# Altium project DSO.PrjPCB
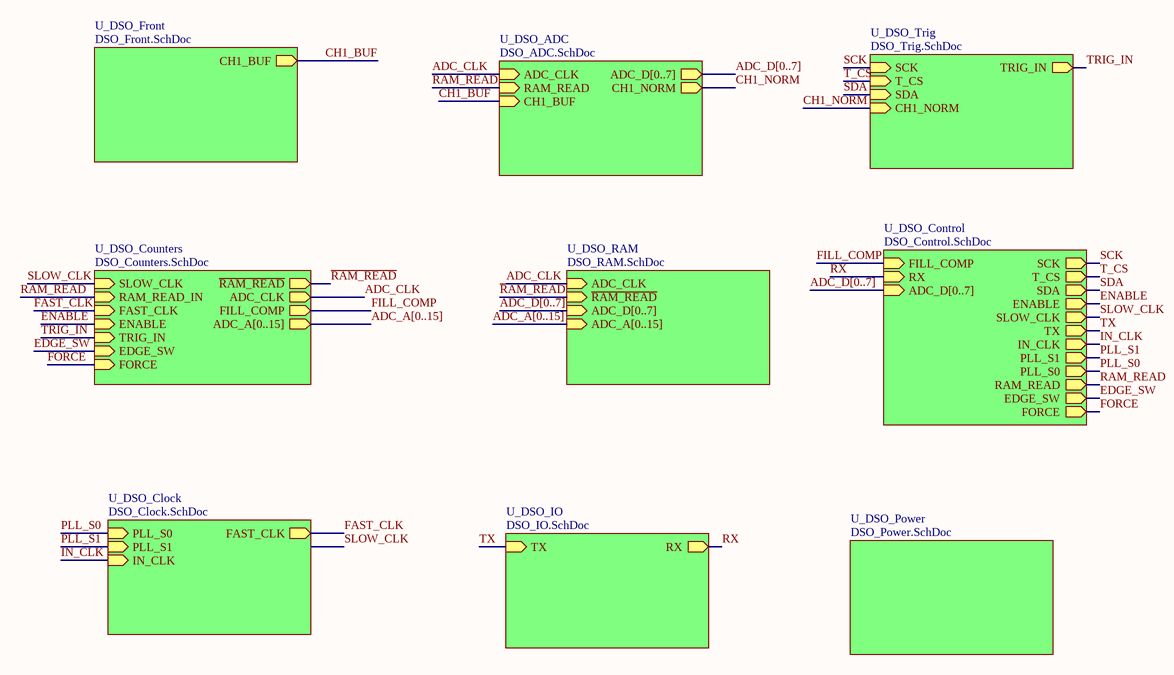
[diagram p0: DSO_Top.SchDoc]
7 sheets, 96 parts. Net scope: hierarchical (ports join the sheet entries above them; power ports are global).
Board file: DSO.PcbDoc
Sheets:
  DSO_Top.SchDoc
    U_DSO_ADC = DSO_ADC.SchDoc
    U_DSO_Clock = DSO_Clock.SchDoc
    U_DSO_Front = DSO_Front.SchDoc
    U_DSO_IO = DSO_IO.SchDoc
    U_DSO_Power = DSO_Power.SchDoc
    U_DSO_Trig = DSO_Trig.SchDoc

## Sheet DSO_Top.SchDoc: Schematic_Name
size A4; CompanyName: University of Melbourne; Engineer: Your Name Here; DocumentNumber: 1; Revision: 0.1; SheetNumber: 1; SheetTotal: 1; Title_Project: Project_Title; StudentNo: Student No.

### Sub-sheets
U_DSO_ADC = DSO_ADC.SchDoc: ADC_CLK (in), ADC_D[0..7] (out), RAM_READ (in), CH1_BUF (in), CH1_NORM (out)
U_DSO_Clock = DSO_Clock.SchDoc: FAST_CLK (out), PLL_S0 (in), PLL_S1 (in), IN_CLK (in)
U_DSO_Control = DSO_Control.SchDoc (file not in this document): SCK (out), T_CS (out), SDA (out), ENABLE (out), FILL_COMP (in), SLOW_CLK (out), TX (out), RX (in), IN_CLK (out), PLL_S1 (out), PLL_S0 (out), RAM_READ (out), ADC_D[0..7] (in), EDGE_SW (out), FORCE (out)
U_DSO_Counters = DSO_Counters.SchDoc (file not in this document): SLOW_CLK (in), ~{RAM_READ} (out), ADC_CLK (out), RAM_READ_IN (in), FAST_CLK (in), FILL_COMP (out), ENABLE (in), TRIG_IN (in), EDGE_SW (in), FORCE (in), ADC_A[0..15] (out)
U_DSO_Front = DSO_Front.SchDoc: CH1_BUF (out)
U_DSO_IO = DSO_IO.SchDoc: TX (in), RX (out)
U_DSO_Power = DSO_Power.SchDoc: no entries
U_DSO_RAM = DSO_RAM.SchDoc (file not in this document): ADC_CLK (in), ~{RAM_READ} (in), ADC_D[0..7] (in), ADC_A[0..15] (in)
U_DSO_Trig = DSO_Trig.SchDoc: SCK (in), T_CS (in), SDA (in), CH1_NORM (in), TRIG_IN (out)

### Nets
ADC_CLK: sheet U_DSO_ADC/ADC_CLK, sheet U_DSO_Counters/ADC_CLK, sheet U_DSO_RAM/ADC_CLK
CH1_BUF: sheet U_DSO_ADC/CH1_BUF, sheet U_DSO_Front/CH1_BUF
CH1_NORM: sheet U_DSO_ADC/CH1_NORM, sheet U_DSO_Trig/CH1_NORM
EDGE_SW: sheet U_DSO_Control/EDGE_SW, sheet U_DSO_Counters/EDGE_SW
ENABLE: sheet U_DSO_Control/ENABLE, sheet U_DSO_Counters/ENABLE
FAST_CLK: sheet U_DSO_Clock/FAST_CLK, sheet U_DSO_Counters/FAST_CLK
FILL_COMP: sheet U_DSO_Control/FILL_COMP, sheet U_DSO_Counters/FILL_COMP
FORCE: sheet U_DSO_Control/FORCE, sheet U_DSO_Counters/FORCE
IN_CLK: sheet U_DSO_Clock/IN_CLK, sheet U_DSO_Control/IN_CLK
PLL_S0: sheet U_DSO_Clock/PLL_S0, sheet U_DSO_Control/PLL_S0  [project net Clk_S0]
PLL_S1: sheet U_DSO_Clock/PLL_S1, sheet U_DSO_Control/PLL_S1  [project net Clk_S1]
~{RAM_READ}: sheet U_DSO_Counters/~{RAM_READ}, sheet U_DSO_RAM/~{RAM_READ}
RAM_READ: sheet U_DSO_ADC/RAM_READ, sheet U_DSO_Control/RAM_READ, sheet U_DSO_Counters/RAM_READ_IN
RX: sheet U_DSO_Control/RX, sheet U_DSO_IO/RX  [project net MCU_RX]
SCK: sheet U_DSO_Control/SCK, sheet U_DSO_Trig/SCK
SDA: sheet U_DSO_Control/SDA, sheet U_DSO_Trig/SDA
SLOW_CLK: sheet U_DSO_Control/SLOW_CLK, sheet U_DSO_Counters/SLOW_CLK
T_CS: sheet U_DSO_Control/T_CS, sheet U_DSO_Trig/T_CS
TRIG_IN: sheet U_DSO_Counters/TRIG_IN, sheet U_DSO_Trig/TRIG_IN
TX: sheet U_DSO_Control/TX, sheet U_DSO_IO/TX  [project net MCU_TX]

### Buses and harness runs
bus ADC_A[0..15] = sheet U_DSO_Counters/ADC_A[0..15]
bus ADC_A[0..15] = sheet U_DSO_RAM/ADC_A[0..15]
bus ADC_D[0..7] = sheet U_DSO_ADC/ADC_D[0..7]
bus ADC_D[0..7] = sheet U_DSO_Control/ADC_D[0..7]
bus ADC_D[0..7] = sheet U_DSO_RAM/ADC_D[0..7]

## Sheet DSO_ADC.SchDoc: Schematic_Name
size A4; CompanyName: University of Melbourne; Engineer: Your Name Here; DocumentNumber: 1; Revision: 0.1; SheetNumber: 1; SheetTotal: 1; Title_Project: Project_Title; StudentNo: Student No.
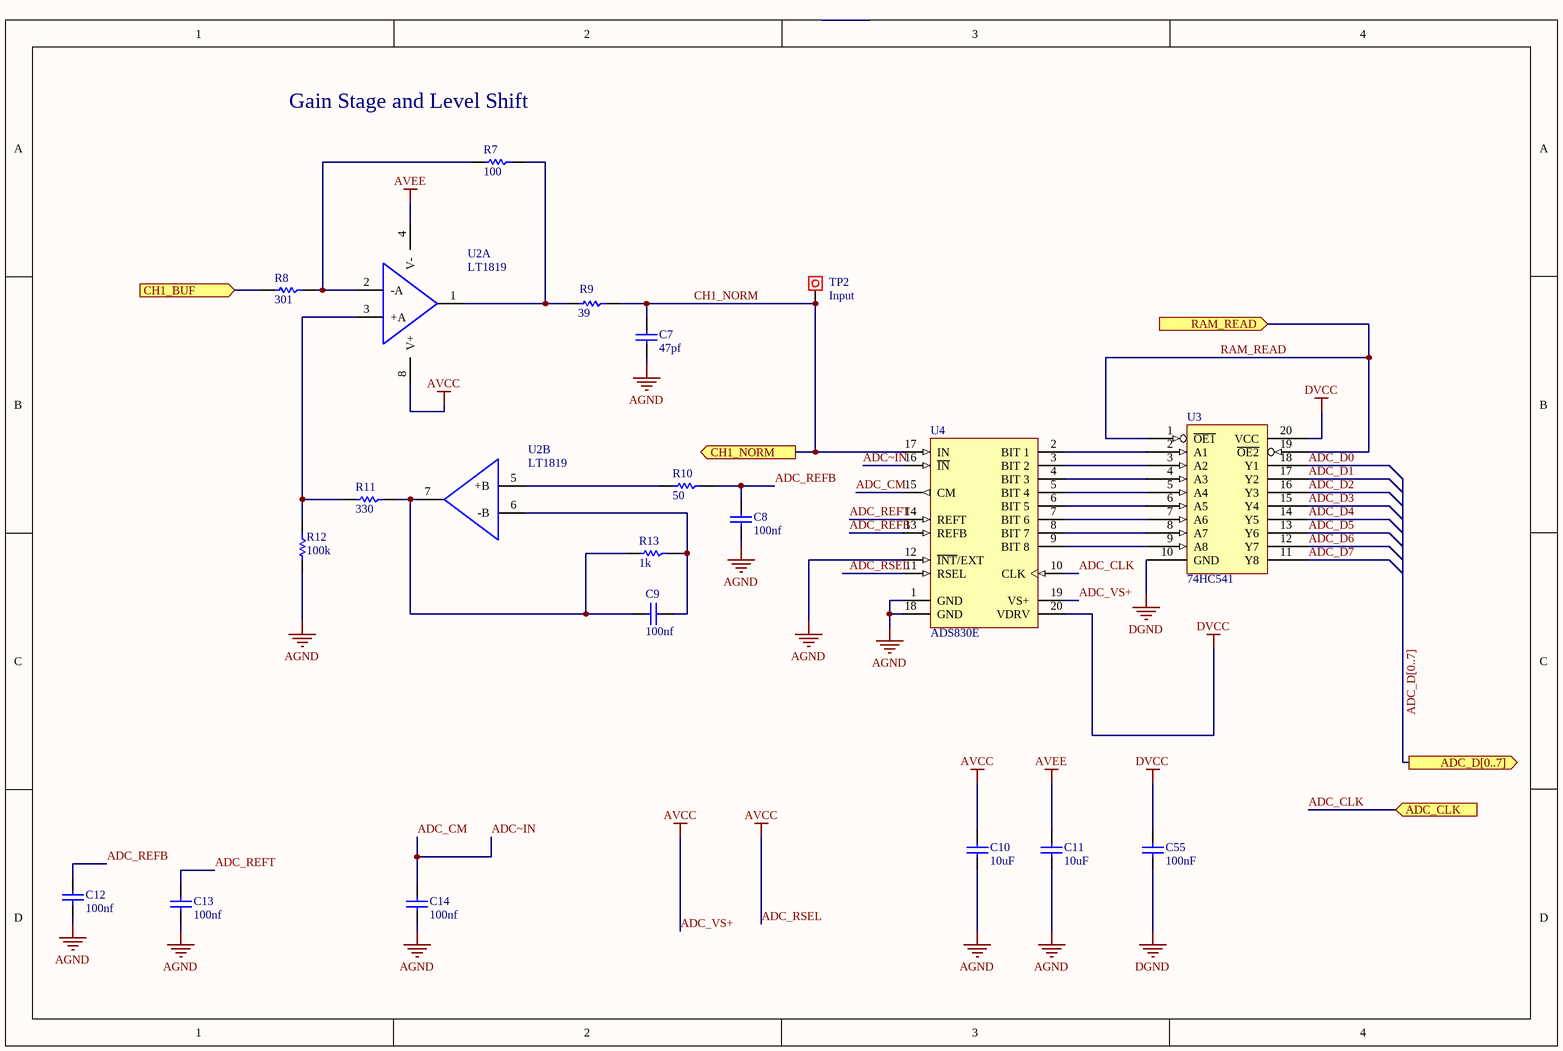
[diagram p1: DSO_ADC.SchDoc]

### Parts
C7  47pf  [0805C]
C8  100nf  [0805C]
C9  100nf  [0805C]
C10  10uF  [0805C]
C11  10uF  [0805C]
C12  100nf  [0805C]
C13  100nf  [0805C]
C14  100nf  [0805C]
C55  100nF  [0805C]
R7  100  [0805]
R8  301  [0805]
R9  39  [0805]
R10  50  [0805]
R11  330  [0805]
R12  100k  [0805]
R13  1k  [0805]
TP2  INPUT  [Testpoin]
U2  LT1819  [MSOP-8]  (parts A,B of 2)
U3  74HC541  [SOT163-1_N]
U4  ADS830E  [TI-DBQ20_L]

### Ports
ADC_CLK (in), ADC_D[0..7] (out), CH1_BUF (in), CH1_NORM (out), RAM_READ (in)

### Nets
ADC_RSEL: C10.1 U2.8(V+) U4.11(RSEL) U4.19(VS+)  [also labelled ADC_VS+, AVCC]
AGND: C7.2 C8.1 C10.2 C11.2 C12.1 C13.1 C14.1 R12.2 U4.1(GND) U4.12(~{INT}/EXT) U4.18(GND)
AVEE: C11.1 U2.4(V-)
DGND: C55.2 U3.10(GND)
DVCC: C55.1 U3.20(VCC) U4.20(VDRV)
ADC_CLK: U4.10(CLK) ; port ADC_CLK
ADC_CM: C14.2 U4.15(CM) U4.16(~{IN})  [also labelled ADC~IN]
ADC_D0: U3.18(Y1)
ADC_D1: U3.17(Y2)
ADC_D2: U3.16(Y3)
ADC_D3: U3.15(Y4)
ADC_D4: U3.14(Y5)
ADC_D5: U3.13(Y6)
ADC_D6: U3.12(Y7)
ADC_D7: U3.11(Y8)
ADC_REFB: C8.2 C12.2 R10.1 U4.13(REFB)
ADC_REFT: C13.2 U4.14(REFT)
CH1_BUF: R8.2 ; port CH1_BUF
CH1_NORM: C7.1 R9.1 TP2.1 U4.17(IN) ; port CH1_NORM
RAM_READ: U3.1(~{OE1}) U3.19(~{OE2}) ; port RAM_READ
NetC9_1: C9.1 R11.1 R13.2 U2.7(OUTB)
NetC9_2: C9.2 R13.1 U2.6(-B)
NetR7_1: R7.1 R9.2 U2.1(OUTA)
NetR7_2: R7.2 R8.1 U2.2(-A)
NetR10_2: R10.2 U2.5(+B)
NetR11_2: R11.2 R12.1 U2.3(+A)
NetU3_2: U3.2(A1) U4.2(BIT_1)
NetU3_3: U3.3(A2) U4.3(BIT_2)
NetU3_4: U3.4(A3) U4.4(BIT_3)
NetU3_5: U3.5(A4) U4.5(BIT_4)
NetU3_6: U3.6(A5) U4.6(BIT_5)
NetU3_7: U3.7(A6) U4.7(BIT_6)
NetU3_8: U3.8(A7) U4.8(BIT_7)
NetU3_9: U3.9(A8) U4.9(BIT_8)

### Buses and harness runs
bus ADC_D[0..7] = port ADC_D[0..7]

### Notes on the sheet
- (near R7) Gain Stage and Level Shift

### Library data of the parts
C7-C14 C55 = C: Capacitor; Reviewed by: RM - 2018/08/05; Revision: July-2002: Re-released for DXP Platform.; Supplier 1: *; Supplier Part Number 1: *
  C7: Value: 47pf
  C8 C9 C12-C14: Value: 100nf
  C10 C11: Value: 10uF
  C55: Value: 100nF
R7-R13 = R: Resistor; Reviewed by: RM - 2018/08/05; Supplier 1: *; Suppler Part Number 1: *
  R7: Value: 100
  R8: Value: 301
  R9: Value: 39
  R10: Value: 50
  R11: Value: 330
  R12: Value: 100k
  R13: Value: 1k
TP2 = Test Point: Pad; Value: Input
U2 = LT1819: OpAmp High Frequency Dual; Reviewed by: RM - 2018/08/05; Supplier 1: Digi-Key; Supplier Part Number 1: LT1819CMS8#PBF-ND
U3 = 74HC541: (ADV) Octal Buffer, Line Driver; Reviewed by: RM - 2018/08/05; Supplier 1: Digi-Key; Supplier Part Number 1: 296-1202-1-ND
U4 = ADS830E: 8-Bit, 60 MSPS ADC Single-Ended / Differential Input, Internal / External Reference and Programmble Input Range, -40 to 85 degC, 20-pin SOP (DBQ20), Green (RoHS & no Sb/Br); Reviewed by: RM - 2018/08/05; ComponentLink2URL: http://www.ti.com/general/docs/lit/getliterature.tsp?genericPartNumber=ADS830&fileType=pdf; ComponentLink2Description: Datasheet; ComponentLink1URL: http://www.ti.com/; ComponentLink3URL: http://www.ti.com/litv/pdf/mpds210a; ComponentLink3Description: Package Specification; ComponentLink1Description: Manufacturer URL; Supplier 1: Digi-Key; Supplier Part Number 1: ADS830E-ND

## Sheet DSO_Clock.SchDoc: Schematic_Name
size A4; CompanyName: University of Melbourne; Engineer: Your Name Here; DocumentNumber: 1; Revision: 0.1; SheetNumber: 1; SheetTotal: 1; Title_Project: Project_Title; StudentNo: Student No.
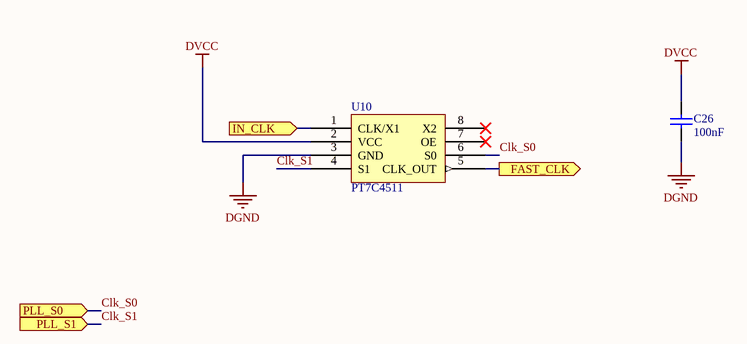
[diagram p2: DSO_Clock.SchDoc]

### Parts
C26  100nF  [0805C]
U10  PT7C4511  [SOIC-8]

### Ports
FAST_CLK (out), IN_CLK (in), PLL_S0 (in), PLL_S1 (in)

### Nets
DGND: C26.2 U10.3(GND)
DVCC: C26.1 U10.2(VCC)
Clk_S0: U10.6(S0) ; port PLL_S0
Clk_S1: U10.4(S1) ; port PLL_S1
FAST_CLK: U10.5(CLK_OUT) ; port FAST_CLK
IN_CLK: U10.1(CLK/X1) ; port IN_CLK

Not connected (* = marked no-connect by the designer): U10 7(OE)* 8(X2)*

### Library data of the parts
C26 = C: Capacitor; Reviewed by: RM - 2018/08/05; Revision: July-2002: Re-released for DXP Platform.; Supplier 1: *; Supplier Part Number 1: *; Value: 100nF
U10 = PT7C4511: PLL Clock Multiplier; Reviewed by: RM - 2018/08/05; Supplier 1: Digi-Key; Supplier Part Number 1: PT7C4511WEXDICT-ND

## Sheet DSO_Front.SchDoc: Schematic_Name
size A4; CompanyName: University of Melbourne; Engineer: Your Name Here; DocumentNumber: 1; Revision: 0.1; SheetNumber: 1; SheetTotal: 1; Title_Project: Project_Title; StudentNo: Student No.
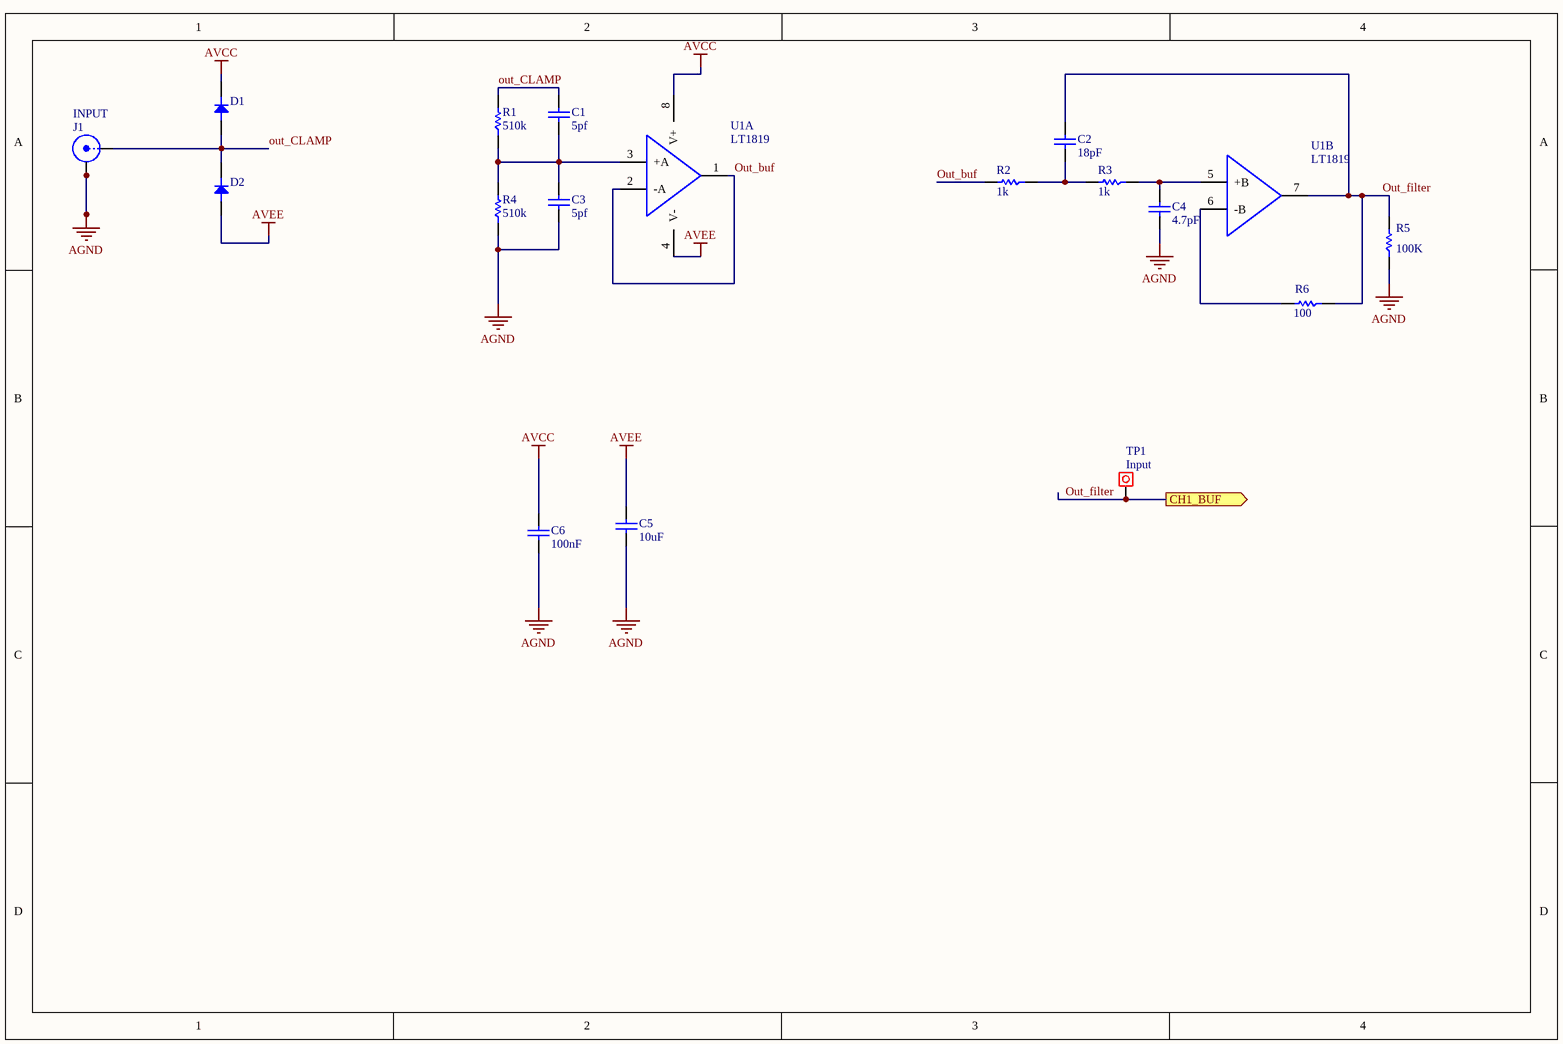
[diagram p3: DSO_Front.SchDoc]

### Parts
C1  5pf  [0805C]
C2  18pF  [0805C]
C3  5pf  [0805C]
C4  4.7pF  [0805C]
C5  10uF  [0805C]
C6  100nF  [0805C]
D1  Diode  [SOD-123]  (value not drawn)
D2  Diode  [SOD-123]  (value not drawn)
J1  INPUT  [BNC_VERT]
R1  510k  [0805]
R2  1k  [0805]
R3  1k  [0805]
R4  510k  [0805]
R5  100K  [0805]
R6  100  [0805]
TP1  INPUT  [Testpoin]
U1  LT1819  [MSOP-8]  (parts A,B of 2)

### Ports
CH1_BUF (out)

### Nets
AGND: C3.2 C4.2 C5.2 C6.2 J1.2(Y) J1.3(Y) J1.4(Y) J1.5(Y) R4.1 R5.1
AVCC: C6.1 D1.K U1.8(V+)  [project net ADC_RSEL]
AVEE: C5.1 D2.A U1.4(V-)
Out_buf: R2.2 U1.1(OUTA) U1.2(-A)
out_CLAMP: C1.1 D1.A D2.K J1.1(X) R1.2
Out_filter: C2.1 R5.2 R6.1 TP1.1 U1.7(OUTB) ; port CH1_BUF  [project net CH1_BUF]
NetC1_2: C1.2 C3.1 R1.1 R4.2 U1.3(+A)
NetC2_2: C2.2 R2.1 R3.2
NetC4_1: C4.1 R3.1 U1.5(+B)
NetR6_2: R6.2 U1.6(-B)

### Library data of the parts
C1-C6 = C: Capacitor; Reviewed by: RM - 2018/08/05; Revision: July-2002: Re-released for DXP Platform.; Supplier 1: *; Supplier Part Number 1: *
  C1 C3: Value: 5pf
  C2: Value: 18pF
  C4: Value: 4.7pF
  C5: Value: 10uF
  C6: Value: 100nF
D1 D2 = D: Reviewed by: RM - 2018/08/05; Revision: July-2002: Re-released for DXP Platform.; Supplier 1: *; Supplier Part Number 1: *
J1 = BNC: BNC Straight; Reviewed by: RM - 2018/08/05; Supplier Part Number 1: A97581-ND; Supplier 1: Digi-Key
R1-R6 = R: Resistor; Reviewed by: RM - 2018/08/05; Supplier 1: *; Suppler Part Number 1: *
  R1 R4: Value: 510k
  R2 R3: Value: 1k
  R5: Value: 100K
  R6: Value: 100
TP1 = Test Point: Pad; Value: Input
U1 = LT1819: as U2 on sheet DSO_ADC; Supplier 1: Digi-Key; Supplier Part Number 1: LT1819CMS8#PBF-ND

## Sheet DSO_IO.SchDoc: Schematic_Name
size A4; CompanyName: University of Melbourne; Engineer: Your Name Here; DocumentNumber: 1; Revision: 0.1; SheetNumber: 1; SheetTotal: 1; Title_Project: Project_Title; StudentNo: Student No.
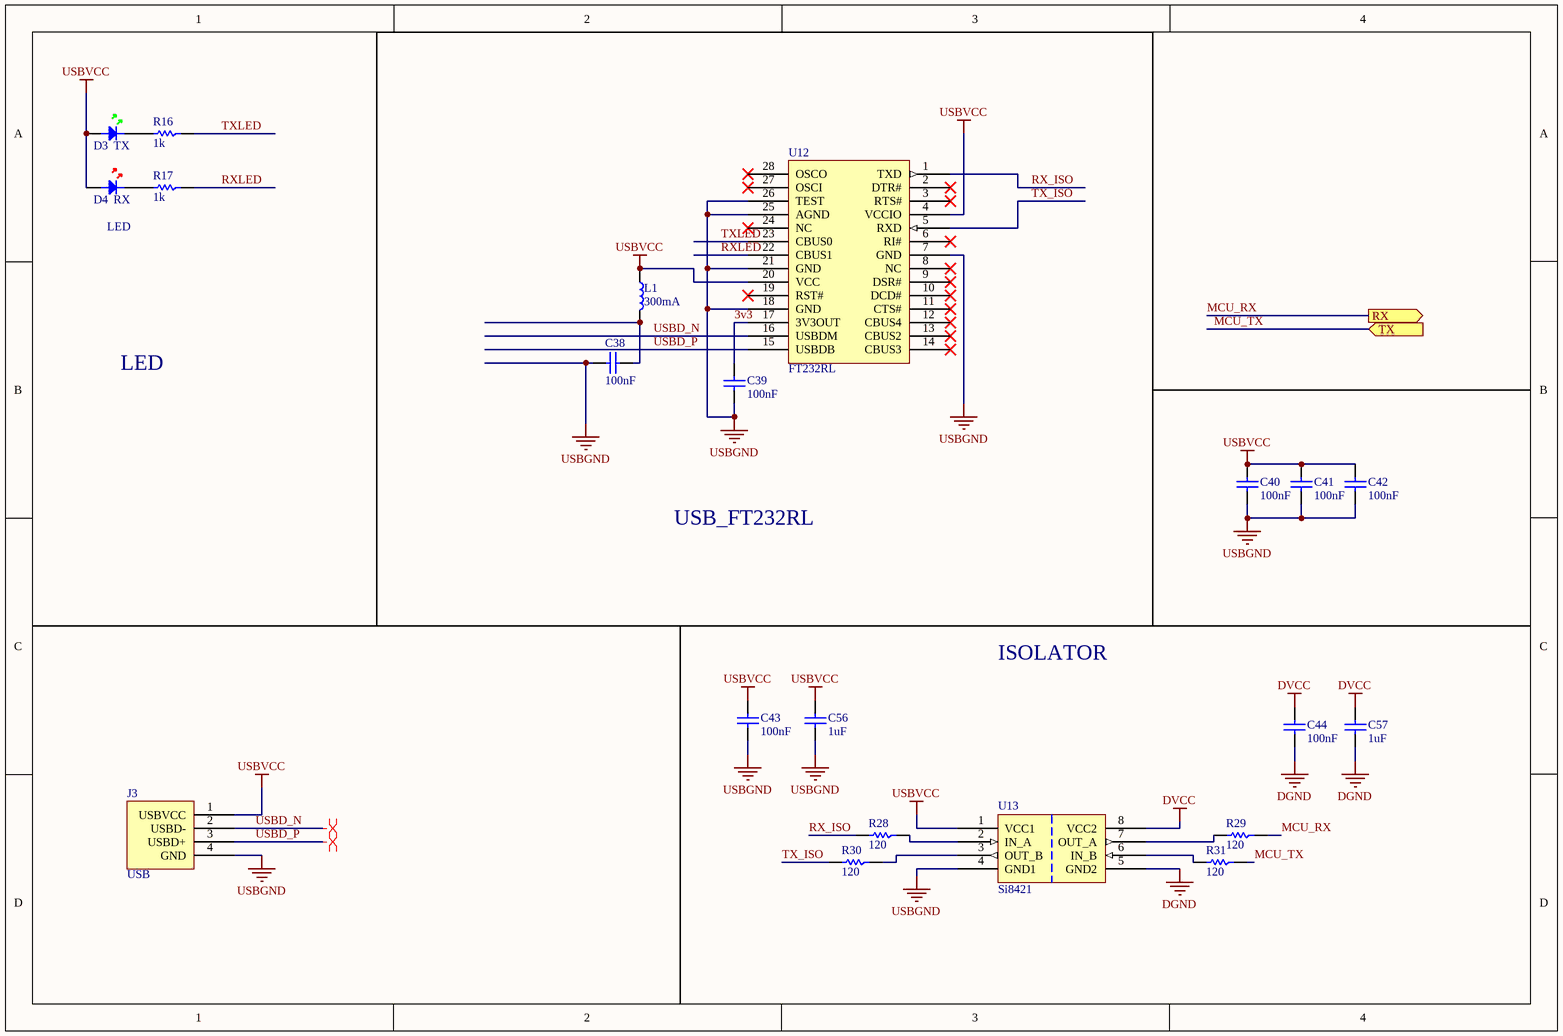
[diagram p4: DSO_IO.SchDoc]

### Parts
C38  100nF  [0805C]
C39  100nF  [0805C]
C40  100nF  [0805C]
C41  100nF  [0805C]
C42  100nF  [0805C]
C43  100nF  [0805C]
C44  100nF  [0805C]
C56  1uF  [0805C]
C57  1uF  [0805C]
D3  TX  [0805D-GREEN]
D4  RX  [0805D-RED]
J3  USB  [USBPLUG]
L1  300mA  [0805]
R16  1k  [0805]
R17  1k  [0805]
R28  120  [0805]
R29  120  [0805]
R30  120  [0805]
R31  120  [0805]
U12  FT232RL  [SSOP-28]
U13  Si8421  [SOIC-8]

### Ports
RX (out), TX (in)

### Nets
DGND: C44.2 C57.2 U13.5(GND2)
DVCC: C44.1 C57.1 U13.8(VCC2)
USBGND: C38.2 C39.2 C40.2 C41.2 C42.2 C43.2 C56.2 J3.4(GND) U12.7(GND) U12.18(GND) U12.21(GND) U12.25(AGND) U12.26(TEST) U13.4(GND1)
USBVCC: C40.1 C41.1 C42.1 C43.1 C56.1 D3.A D4.A J3.1(USBVCC) L1.1 U12.4(VCCIO) U12.20(VCC) U13.1(VCC1)
3v3: C39.1 U12.17(3V3OUT)
MCU_RX: R29.1 ; port RX
MCU_TX: R31.1 ; port TX
RX_ISO: R28.2 U12.1(TXD)
RXLED: R17.1 U12.22(CBUS1)
TX_ISO: R30.2 U12.5(RXD)
TXLED: R16.1 U12.23(CBUS0)
USBD_N: J3.2(USBD-) U12.16(USBDM)
USBD_P: J3.3(USBD+) U12.15(USBDB)
NetC38_1: C38.1 L1.2
NetD3_K: D3.K R16.2
NetD4_K: D4.K R17.2
NetR28_1: R28.1 U13.2(IN_A)
NetR29_2: R29.2 U13.7(OUT_A)
NetR30_1: R30.1 U13.3(OUT_B)
NetR31_2: R31.2 U13.6(IN_B)

Not connected (* = marked no-connect by the designer): U12 2(DTR#)* 3(RTS#)* 6(RI#)* 8(NC)* 9(DSR#)* 10(DCD#)* 11(CTS#)* 12(CBUS4)* 13(CBUS2)* 14(CBUS3)* 19(RST#)* 24(NC)* 27(OSCI)* 28(OSCO)*

### Layout directives
differential pair: USBD_N, USBD_P

### Notes on the sheet
- LED
- USB_FT232RL
- ISOLATOR

### Library data of the parts
C38-C44 C56 C57 = C: Capacitor; Reviewed by: RM - 2018/08/05; Revision: July-2002: Re-released for DXP Platform.; Supplier 1: *; Supplier Part Number 1: *
  C38-C44: Value: 100nF
  C56 C57: Value: 1uF
D3 = LED GREEN: Light Emitting Diode; Reviewed by: RM - 2018/08/05; Revision: July-2002: Re-released for DXP Platform.; Supplier 1: Digi-Key; Supplier Part Number 1: 160-1423-1-ND
D4 = LED RED: Light Emitting Diode; Reviewed by: RM - 2018/08/05; Revision: July-2002: Re-released for DXP Platform.; Supplier 1: Digi-Key; Supplier Part Number 1: 475-1415-1-ND
J3 = USBPLUG: USB B Type Connector; Reviewed by: RM - 2018/08/05; Supplier 1: Digi-Key; Supplier Part Number 1: 609-1039-ND
L1 = I: Inductor; Reviewed by: RM - 2018/08/05; Value: 300mA; Supplier 1: *; Supplier Part Number 1: *
R16 R17 R28-R31 = R: Resistor; Reviewed by: RM - 2018/08/05; Supplier 1: *; Suppler Part Number 1: *
  R16 R17: Value: 1k
  R28-R31: Value: 120
U12 = FT232RL: USB to Serial bridge; Reviewed by: RM - 2018/08/05; Supplier 1: Digi-Key; Supplier Part Number 1: 768-1007-1-ND
U13 = Si8421: Dual Channel Digital Isolator Both Ways; Reviewed by: RM - 2018/08/05; Supplier 1: Digi-Key; Supplier Part Number 1: 336-1755-5-ND

## Sheet DSO_Power.SchDoc: Schematic_Name
size A4; CompanyName: University of Melbourne; Engineer: Your Name Here; DocumentNumber: 1; Revision: 0.1; SheetNumber: 1; SheetTotal: 1; Title_Project: Project_Title; StudentNo: Student No.
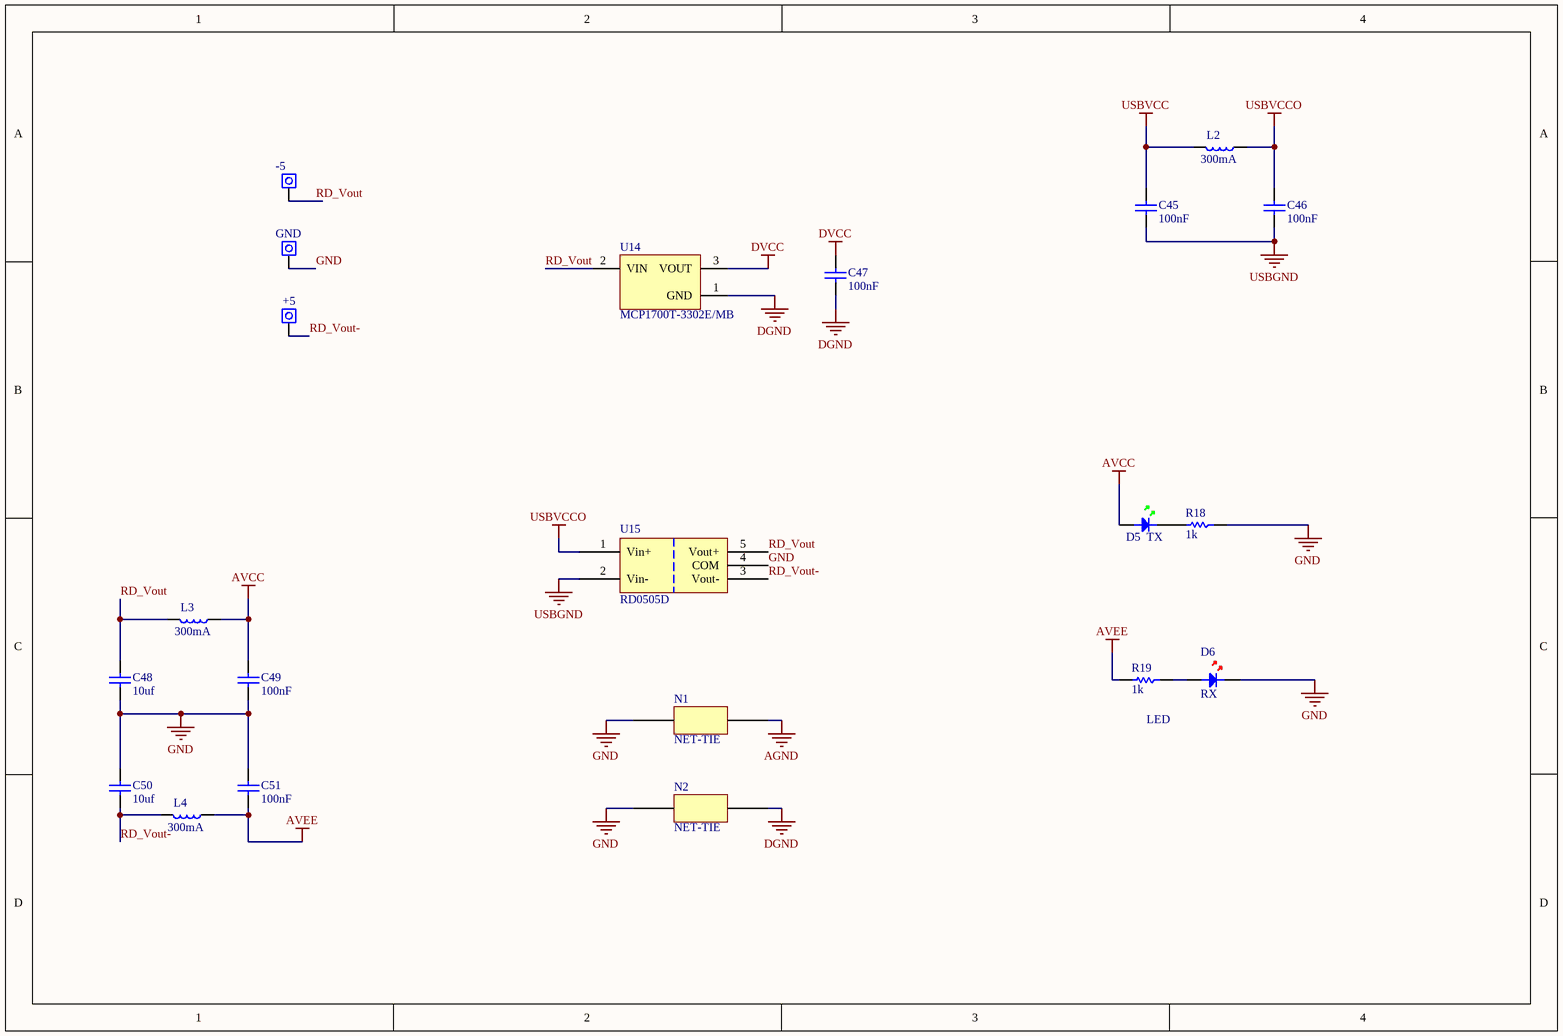
[diagram p5: DSO_Power.SchDoc]

### Parts
C45  100nF  [0805C]
C46  100nF  [0805C]
C47  100nF  [0805C]
C48  10uf  [0805C]
C49  100nF  [0805C]
C50  10uf  [0805C]
C51  100nF  [0805C]
D5  TX  [0805D-GREEN]
D6  RX  [0805D-RED]
L2  300mA  [0805]
L3  300mA  [0805]
L4  300mA  [0805]
N1  NET-TIE  [NET-TIE]  (net tie, no BOM)
N2  NET-TIE  [NET-TIE]  (net tie, no BOM)
R18  1k  [0805]
R19  1k  [0805]
TP4  -5  [PIN 1.8mm]
TP5  GND  [PIN 1.8mm]
TP6  +5  [PIN 1.8mm]
U14  MCP1700T-3302E/MB  [SOT89]
U15  RD0505D  [SIP_NMG]

### Nets
AGND: N1.1
AVCC: C49.1 D5.A L3.1  [project net ADC_RSEL]
AVEE: C51.2 L4.1 R19.2
DGND: C47.2 N2.1 U14.1(GND)
DVCC: C47.1 U14.3(VOUT)
GND: C48.2 C49.2 C50.1 C51.1 D6.A N1.0 N2.0 R18.1 TP5.1 U15.4(COM)
USBGND: C45.2 C46.2 U15.2(Vin-)
USBVCC: C45.1 L2.2
USBVCCO: C46.1 L2.1 U15.1(Vin+)
RD_Vout: C48.1 L3.2 TP4.1 U14.2(VIN) U15.5(Vout+)
RD_Vout-: C50.2 L4.2 TP6.1 U15.3(Vout-)
NetD5_K: D5.K R18.2
NetD6_K: D6.K R19.1

### Notes on the sheet
- LED

### Library data of the parts
C45-C51 = C: Capacitor; Reviewed by: RM - 2018/08/05; Revision: July-2002: Re-released for DXP Platform.; Supplier 1: *; Supplier Part Number 1: *
  C45-C47 C49 C51: Value: 100nF
  C48 C50: Value: 10uf
D5 = LED GREEN: as D3 on sheet DSO_IO; Revision: July-2002: Re-released for DXP Platform.; Supplier 1: Digi-Key; Supplier Part Number 1: 160-1423-1-ND
D6 = LED RED: as D4 on sheet DSO_IO; Revision: July-2002: Re-released for DXP Platform.; Supplier 1: Digi-Key; Supplier Part Number 1: 475-1415-1-ND
L2-L4 = I: Inductor; Reviewed by: RM - 2018/08/05; Supplier 1: *; Supplier Part Number 1: *; Value: 300mA
R18 R19 = R: Resistor; Reviewed by: RM - 2018/08/05; Value: 1k; Supplier 1: *; Suppler Part Number 1: *
TP4-TP6 = WIRE: Pad
U14 = MCP1700T: Low Quiescent Current LDO, 3-Pin SOT-89, Extended Temperature, Tape and Reel; Reviewed by: RM - 2018/08/05; Supplier 1: Digi-Key; Supplier Part Number 1: MCP1700T3302EMBCT-ND
U15 = RD0505D: (ADV) DC to DC converter 5V in +-5V out; Reviewed by: RM - 2018/08/05; Supplier Part Number 1: 945-1136-ND; Supplier 1: Digi-Key

## Sheet DSO_Trig.SchDoc: Schematic_Name
size A4; CompanyName: University of Melbourne; Engineer: Your Name Here; DocumentNumber: 1; Revision: 0.1; SheetNumber: 1; SheetTotal: 1; Title_Project: Project_Title; StudentNo: Student No.
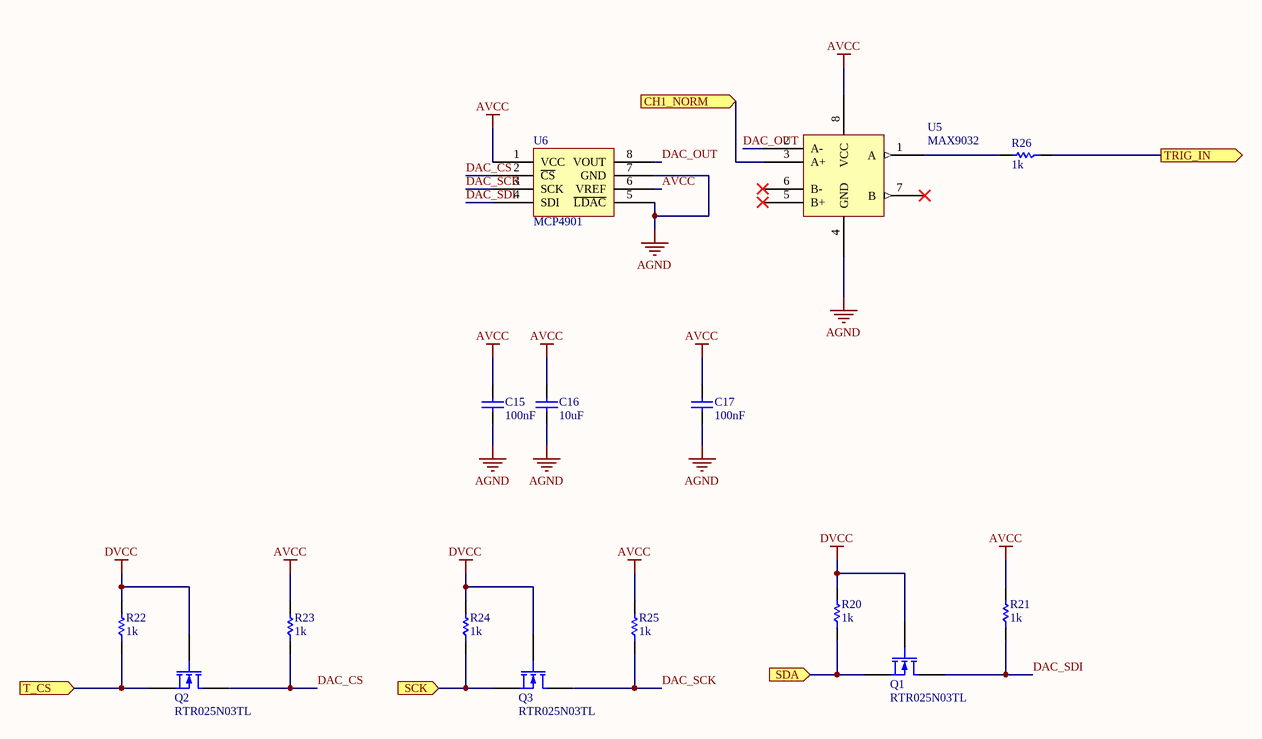
[diagram p6: DSO_Trig.SchDoc]

### Parts
C15  100nF  [0805C]
C16  10uF  [0805C]
C17  100nF  [0805C]
Q1  RTR025N03TL  [SOT23]
Q2  RTR025N03TL  [SOT23]
Q3  RTR025N03TL  [SOT23]
R20  1k  [0805]
R21  1k  [0805]
R22  1k  [0805]
R23  1k  [0805]
R24  1k  [0805]
R25  1k  [0805]
R26  1k  [0805]
U5  MAX9032  [SOIC-8]
U6  MCP4901  [SOIC-8]

### Ports
CH1_NORM (in), SCK (in), SDA (in), T_CS (in), TRIG_IN (out)

### Nets
AGND: C15.2 C16.2 C17.2 U5.4(GND) U6.5(~{LDAC}) U6.7(GND)
AVCC: C15.1 C16.1 C17.1 R21.2 R23.2 R25.2 U5.8(VCC) U6.1(VCC) U6.6(VREF)  [project net ADC_RSEL]
DVCC: Q1.1 Q2.1 Q3.1 R20.2 R22.2 R24.2
CH1_NORM: U5.3(A+) ; port CH1_NORM
DAC_CS: Q2.3 R23.1 U6.2(~{CS})
DAC_OUT: U5.2(A-) U6.8(VOUT)
DAC_SCK: Q3.3 R25.1 U6.3(SCK)
DAC_SDI: Q1.3 R21.1 U6.4(SDI)
SCK: Q3.2 R24.1 ; port SCK
SDA: Q1.2 R20.1 ; port SDA
T_CS: Q2.2 R22.1 ; port T_CS
TRIG_IN: R26.1 ; port TRIG_IN
NetR26_2: R26.2 U5.1(A)

Not connected (* = marked no-connect by the designer): U5 5(B+)* 6(B-)* 7(B)*

### Library data of the parts
C15-C17 = C: Capacitor; Reviewed by: RM - 2018/08/05; Revision: July-2002: Re-released for DXP Platform.; Supplier 1: *; Supplier Part Number 1: *
  C15 C17: Value: 100nF
  C16: Value: 10uF
Q1-Q3 = MOSFET-N: N-Channel MOSFET; PackageDocument: 1995/1996; Published: 8-Jun-2000; LatestRevisionDate: 17-Jul-2002; LatestRevisionNote: Re-released for DXP Platform.; PackageReference: E3; Publisher: Altium Limited
R20-R26 = R: Resistor; Reviewed by: RM - 2018/08/05; Supplier 1: *; Suppler Part Number 1: *; Value: 1k
U5 = MAX9032: Dual Comparator; Reviewed by: RM - 2018/08/05; Supplier 1: Digi-Key; Supplier Part Number 1: MAX9032ASA-ND
U6 = MCP4901: DAC 8bit SPI; Reviewed by: RM - 2018/08/05; Supplier 1: Digi-Key; Supplier Part Number 1: MCP4901-E/SN-ND

## Nets that join several sheets
ADC_RSEL: DSO_ADC (C10.1 U2.8 U4.11 U4.19), DSO_Front (C6.1 D1.K U1.8), DSO_Power (C49.1 D5.A L3.1), DSO_Trig (9 pins)
AGND: DSO_ADC (11 pins), DSO_Front (10 pins), DSO_Power (N1.1), DSO_Trig (6 pins)
AVEE: DSO_ADC (C11.1 U2.4), DSO_Front (C5.1 D2.A U1.4), DSO_Power (C51.2 L4.1 R19.2)
DGND: DSO_ADC (C55.2 U3.10), DSO_Clock (C26.2 U10.3), DSO_IO (C44.2 C57.2 U13.5), DSO_Power (C47.2 N2.1 U14.1)
DVCC: DSO_ADC (C55.1 U3.20 U4.20), DSO_Clock (C26.1 U10.2), DSO_IO (C44.1 C57.1 U13.8), DSO_Power (C47.1 U14.3), DSO_Trig (6 pins)
USBGND: DSO_IO (14 pins), DSO_Power (C45.2 C46.2 U15.2)
USBVCC: DSO_IO (12 pins), DSO_Power (C45.1 L2.2)
CH1_BUF: DSO_ADC (R8.2), DSO_Front (5 pins)
CH1_NORM: DSO_ADC (C7.1 R9.1 TP2.1 U4.17), DSO_Trig (U5.3)